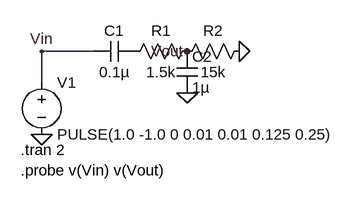
[diagram p0: schematic FF1.asc]
FF1.asc, the LTspice schematic file:
Version 4
SHEET 1 880 680
WIRE 144 80 64 80
WIRE 64 128 64 80
FLAG 64 208 0
FLAG 288 144 0
FLAG 368 80 0
FLAG 64 80 Vin
FLAG 288 80 Vout
SYMBOL voltage 64 112 R0
WINDOW 123 0 0 Left 0
WINDOW 39 0 0 Left 0
SYMATTR InstName V1
SYMATTR Value PULSE(1.0 -1.0 0 0.01 0.01 0.125 0.25)
SYMBOL cap 208 64 R90
WINDOW 0 0 32 VBottom 2
WINDOW 3 32 32 VTop 2
SYMATTR InstName C1
SYMATTR Value 0.1µ
SYMBOL res 304 64 R90
WINDOW 0 0 56 VBottom 2
WINDOW 3 32 56 VTop 2
SYMATTR InstName R1
SYMATTR Value 1.5k
SYMBOL cap 272 80 R0
SYMATTR InstName C2
SYMATTR Value 1µ
SYMBOL res 384 64 R90
WINDOW 0 0 56 VBottom 2
WINDOW 3 32 56 VTop 2
SYMATTR InstName R2
SYMATTR Value 15k
TEXT 32 232 Left 2 !.tran 2\n.probe v(Vin) v(Vout)

The netlist it stands for:
* FF1.asc
V1 Vin 0 PULSE(1.0 -1.0 0 0.01 0.01 0.125 0.25)
C1 P001 Vin 0.1µ
R1 Vout P001 1.5k
C2 Vout 0 1µ
R2 0 Vout 15k
.tran 2
.probe v(Vin) v(Vout)
.backanno
.end